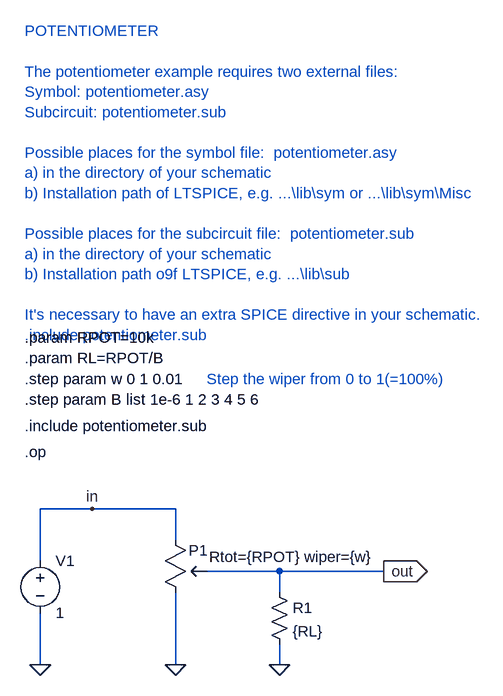
[diagram p0: schematic potentiometer_test_step2.asc]
potentiometer_test_step2.asc, the LTspice schematic file:
Version 4
SHEET 1 1088 680
WIRE 400 320 320 320
WIRE 528 320 400 320
WIRE 528 368 528 320
WIRE 320 400 320 320
WIRE 688 416 576 416
WIRE 848 416 688 416
WIRE 688 448 688 416
WIRE 320 560 320 480
WIRE 528 560 528 448
WIRE 688 560 688 528
FLAG 320 560 0
FLAG 848 416 out
IOPIN 848 416 Out
FLAG 528 560 0
FLAG 688 560 0
FLAG 400 320 in
SYMBOL potentiometer 512 352 R0
WINDOW 3 68 42 Left 0
SYMATTR Value Rtot={RPOT} wiper={w}
SYMATTR InstName P1
SYMBOL voltage 320 384 R0
SYMATTR InstName V1
SYMATTR Value 1
SYMBOL res 672 432 R0
SYMATTR InstName R1
SYMATTR Value {RL}
TEXT 296 232 Left 0 !.op
TEXT 296 192 Left 0 !.include potentiometer.sub
TEXT 296 -416 Left 0 ;POTENTIOMETER\n \nThe potentiometer example requires two external files: \nSymbol: potentiometer.asy\nSubcircuit: potentiometer.sub\n \nPossible places for the symbol file:  potentiometer.asy\na) in the directory of your schematic\nb) Installation path of LTSPICE, e.g. ...\\lib\\sym or ...\\lib\\sym\\Misc\n \nPossible places for the subcircuit file:  potentiometer.sub\na) in the directory of your schematic\nb) Installation path o9f LTSPICE, e.g. ...\\lib\\sub\n \nIt's necessary to have an extra SPICE directive in your schematic.\n.include potentiometer.sub
TEXT 296 120 Left 0 !.step param w 0 1 0.01\n.step param B list 1e-6 1 2 3 4 5 6
TEXT 576 120 Left 0 ;Step the wiper from 0 to 1(=100%)
TEXT 296 56 Left 0 !.param RPOT=10k\n.param RL=RPOT/B

The netlist it stands for:
* potentiometer_test_step2.asc
XP1 in 0 out potentiometer Rtot={RPOT} wiper={w}  ; pins A B C
V1 in 0 1
R1 out 0 {RL}
.op
.include potentiometer.sub
* POTENTIOMETER
* The potentiometer example requires two external files:
* Symbol: potentiometer.asy
* Subcircuit: potentiometer.sub
* Possible places for the symbol file:  potentiometer.asy
* a) in the directory of your schematic
* b) Installation path of LTSPICE, e.g. ...\lib\sym or ...\lib\sym\Misc
* Possible places for the subcircuit file:  potentiometer.sub
* a) in the directory of your schematic
* b) Installation path o9f LTSPICE, e.g. ...\lib\sub
* It's necessary to have an extra SPICE directive in your schematic.
* .include potentiometer.sub
.step param w 0 1 0.01
.step param B list 1e-6 1 2 3 4 5 6
* Step the wiper from 0 to 1(=100%)
.param RPOT=10k
.param RL=RPOT/B
.backanno
.end